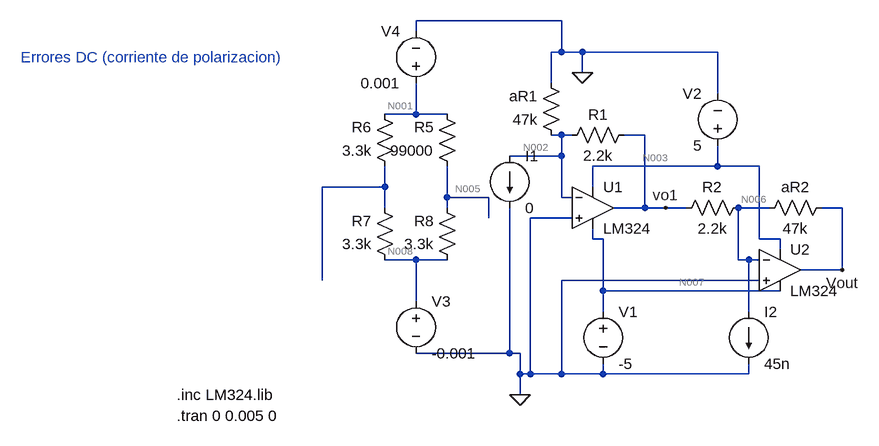
[diagram p0: schematic circuito2.3.asc]
circuito2.3.asc, the LTspice schematic file:
Version 4
SHEET 1 880 680
WIRE 144 -144 -80 -144
WIRE -80 -128 -80 -144
WIRE 144 -96 144 -144
WIRE 144 -96 128 -96
WIRE 176 -96 144 -96
WIRE 384 -96 176 -96
WIRE 176 -64 176 -96
WIRE 128 -48 128 -96
WIRE 384 -32 384 -96
WIRE -80 0 -80 -48
WIRE -80 0 -128 0
WIRE -32 0 -80 0
WIRE 144 32 128 32
WIRE 160 32 144 32
WIRE 272 32 240 32
WIRE 144 64 144 32
WIRE 144 64 64 64
WIRE 384 80 384 48
WIRE 384 80 192 80
WIRE 448 80 384 80
WIRE -128 112 -128 80
WIRE -128 112 -224 112
WIRE 192 112 192 80
WIRE -32 128 -32 80
WIRE 32 128 -32 128
WIRE 144 128 144 64
WIRE 160 128 144 128
WIRE -128 144 -128 112
WIRE -32 144 -32 128
WIRE 272 144 272 32
WIRE 272 144 224 144
WIRE 304 144 272 144
WIRE 336 144 304 144
WIRE 464 144 416 144
WIRE 576 144 544 144
WIRE 32 160 32 128
WIRE 160 160 96 160
WIRE 192 192 192 176
WIRE 208 192 192 192
WIRE 448 192 448 80
WIRE 480 192 448 192
WIRE 480 208 480 192
WIRE -80 224 -128 224
WIRE -32 224 -80 224
WIRE 416 224 416 144
WIRE 432 224 416 224
WIRE 448 224 432 224
WIRE 576 240 576 144
WIRE 576 240 512 240
WIRE -224 256 -224 112
WIRE 448 256 144 256
WIRE 208 272 208 192
WIRE 480 272 208 272
WIRE -80 288 -80 224
WIRE 208 304 208 272
WIRE 432 304 432 224
WIRE 64 368 64 144
WIRE 64 368 -80 368
WIRE 80 368 64 368
WIRE 80 400 80 368
WIRE 96 400 96 160
WIRE 96 400 80 400
WIRE 144 400 144 256
WIRE 144 400 96 400
WIRE 208 400 208 384
WIRE 208 400 144 400
WIRE 432 400 432 384
WIRE 432 400 208 400
WIRE 80 432 80 400
FLAG 80 432 0
FLAG 176 -64 0
FLAG 576 240 Vout
FLAG 304 144 vo1
SYMBOL opamp2 192 80 R0
SYMATTR InstName U1
SYMATTR Value LM324
SYMBOL res 256 16 R90
WINDOW 0 0 56 VBottom 2
WINDOW 3 32 56 VTop 2
SYMATTR InstName R1
SYMATTR Value 2.2k
SYMBOL res 432 128 R90
WINDOW 0 0 56 VBottom 2
WINDOW 3 32 56 VTop 2
SYMATTR InstName R2
SYMATTR Value 2.2k
SYMBOL res 560 128 R90
WINDOW 0 0 56 VBottom 2
WINDOW 3 32 56 VTop 2
SYMATTR InstName aR2
SYMATTR Value 47k
SYMBOL res 144 48 R180
WINDOW 0 36 76 Left 2
WINDOW 3 36 40 Left 2
SYMATTR InstName aR1
SYMATTR Value 47k
SYMBOL res -16 96 R180
WINDOW 0 36 76 Left 2
WINDOW 3 36 40 Left 2
SYMATTR InstName R5
SYMATTR Value 99000
SYMBOL res -112 96 R180
WINDOW 0 36 76 Left 2
WINDOW 3 36 40 Left 2
SYMATTR InstName R6
SYMATTR Value 3.3k
SYMBOL res -112 240 R180
WINDOW 0 36 76 Left 2
WINDOW 3 36 40 Left 2
SYMATTR InstName R7
SYMATTR Value 3.3k
SYMBOL res -16 240 R180
WINDOW 0 36 76 Left 2
WINDOW 3 36 40 Left 2
SYMATTR InstName R8
SYMATTR Value 3.3k
SYMBOL voltage 208 288 R0
WINDOW 123 0 0 Left 0
WINDOW 39 0 0 Left 0
SYMATTR InstName V1
SYMATTR Value -5
SYMBOL voltage 384 64 R180
WINDOW 0 24 96 Left 2
WINDOW 3 24 16 Left 2
WINDOW 123 0 0 Left 0
WINDOW 39 0 0 Left 0
SYMATTR InstName V2
SYMATTR Value 5
SYMBOL OpAmps\\opamp2 480 176 R0
SYMATTR InstName U2
SYMATTR Value LM324
SYMBOL voltage -80 272 R0
WINDOW 123 0 0 Left 0
WINDOW 39 0 0 Left 0
SYMATTR InstName V3
SYMATTR Value -0.001
SYMBOL voltage -80 -32 R180
WINDOW 0 24 96 Left 2
WINDOW 3 24 16 Left 2
WINDOW 123 0 0 Left 0
WINDOW 39 0 0 Left 0
SYMATTR InstName V4
SYMATTR Value 0.001
SYMBOL current 64 64 R0
WINDOW 123 0 0 Left 0
WINDOW 39 0 0 Left 0
SYMATTR InstName I1
SYMATTR Value 0
SYMBOL current 432 304 R0
WINDOW 123 0 0 Left 0
WINDOW 39 0 0 Left 0
SYMATTR InstName I2
SYMATTR Value 45n
TEXT -448 432 Left 2 !.inc LM324.lib
TEXT -448 464 Left 2 !.tran 0 0.005 0
TEXT -688 -88 Left 2 ;Errores DC (corriente de polarizacion)

The netlist it stands for:
* circuito2.3.asc
XU1 0 N002 N003 N007 vo1 LM324  ; pins In+ In- V+ V- OUT
R1 vo1 N002 2.2k
R2 N006 vo1 2.2k
R§aR2 Vout N006 47k
R§aR1 N002 0 47k
R5 N005 N001 99000
R6 N004 N001 3.3k
R7 N008 N004 3.3k
R8 N008 N005 3.3k
V1 N007 0 -5
V2 N003 0 5
XU2 0 N006 N003 N007 Vout LM324  ; pins In+ In- V+ V- OUT
V3 N008 0 -0.001
V4 N001 0 0.001
I1 N002 0 0
I2 N006 0 45n
.inc LM324.lib
.tran 0 0.005 0
* Errores DC (corriente de polarizacion)
.backanno
.end

* Results of the author's LTspice run, read from the files saved beside the schematic
* Operating Point, zero values left out:
*   V(vo1) = -79.11 µV
*   V(n007) = -5 V
*   V(n003) = 5 V
*   V(n002) = -33.65 µV
*   V(n006) = -33.68 µV
*   V(vout) = 2.115 mV
*   V(n005) = -935.5 µV
*   V(n001) = 1 mV
*   V(n008) = -1 mV
*   I(I2) = 45 nA
*   I(R8) = -19.55 nA
*   I(R7) = -303 nA
*   I(R6) = -303 nA
*   I(R5) = -19.55 nA
*   I(Ar1) = -716.1 pA
*   I(Ar2) = 45.71 nA
*   I(R2) = 20.65 nA
*   I(R1) = -20.66 nA
*   I(V4) = -322.6 nA
*   I(V3) = 322.6 nA
*   I(V2) = -679.9 µA
*   I(V1) = 679.8 µA
*   Ix(u1:1) = -19.93 nA
*   Ix(u1:2) = -19.94 nA
*   Ix(u1:3) = 340 µA
*   Ix(u1:4) = -339.9 µA
*   Ix(u1:5) = 41.31 nA
*   Ix(u2:1) = -19.93 nA
*   Ix(u2:2) = -19.94 nA
*   Ix(u2:3) = 340 µA
*   Ix(u2:4) = -339.9 µA
*   Ix(u2:5) = -45.71 nA